# Altium schematic sheet 电源.SchDoc
size A4; SheetNumber: 2; SheetTotal: 6
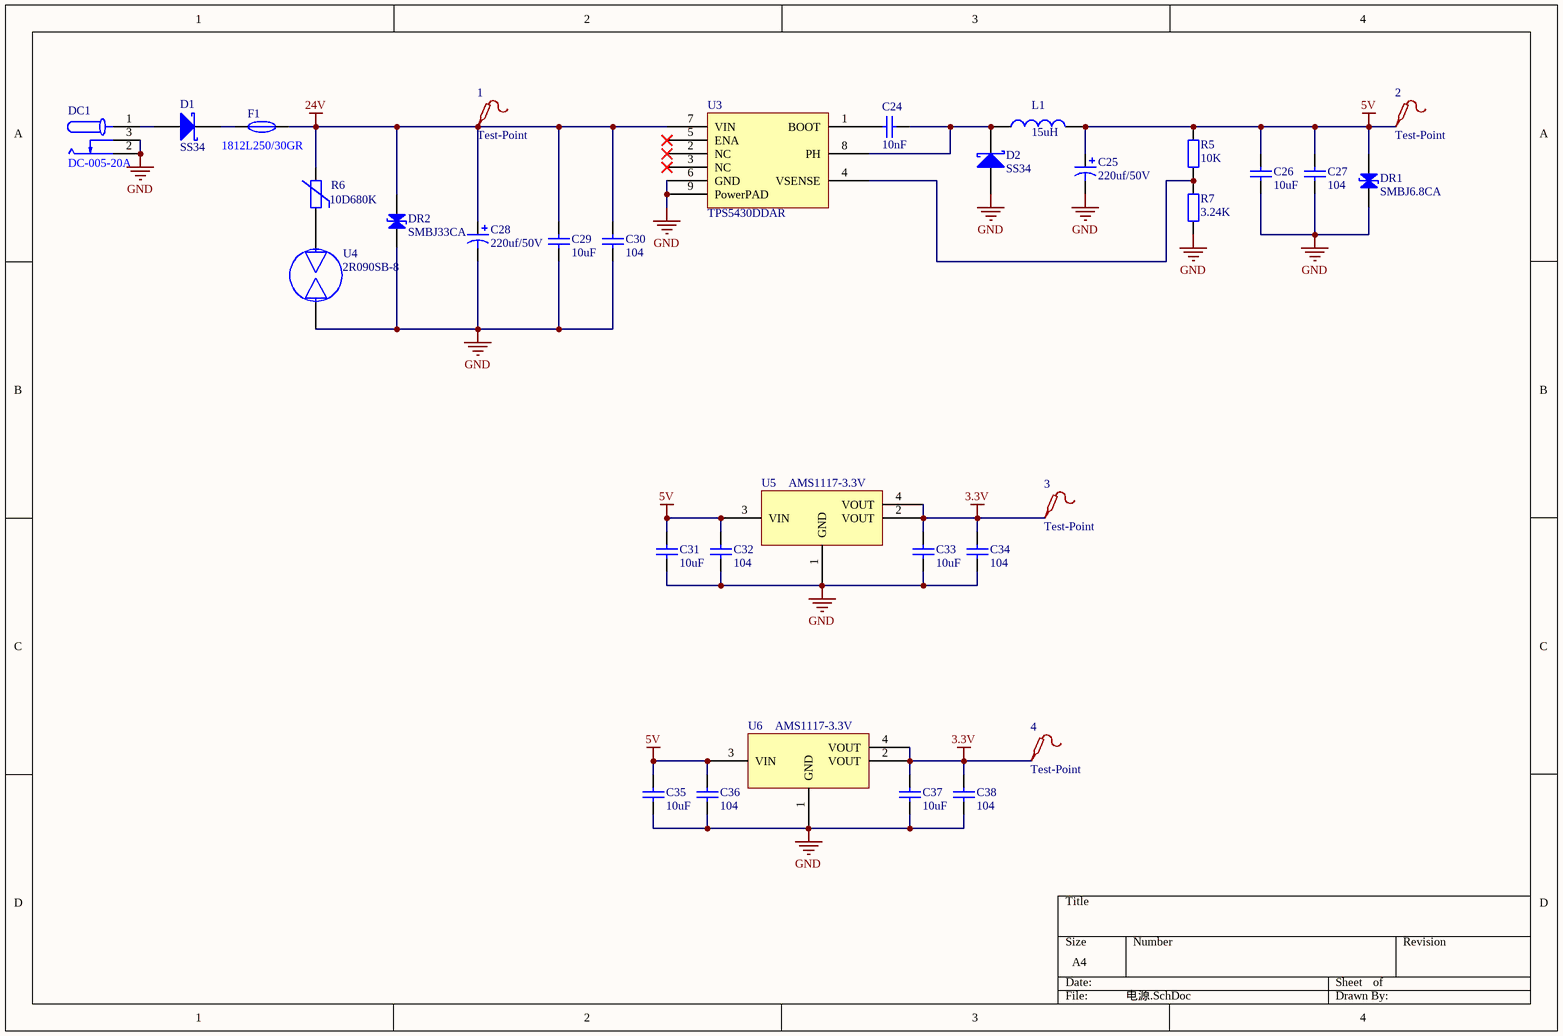
[diagram p0: 电源.SchDoc]

## Parts
1  Test-Point  [Test-Point-0.5mm]
2  Test-Point  [Test-Point-0.5mm]
3  Test-Point  [Test-Point-0.5mm]
4  Test-Point  [Test-Point-0.5mm]
C24  10nF  [C 0603_L]
C25  220uf/50V  [CAP 2.5*6.3*11.2 - GD]
C26  10uF  [C 0603_L]
C27  104  [C 0603_L]
C28  220uf/50V  [CAP 2.5*6.3*11.2 - GD]
C29  10uF  [C 0603_L]
C30  104  [C 0603_L]
C31  10uF  [C 0603_L]
C32  104  [C 0603_L]
C33  10uF  [C 0603_L]
C34  104  [C 0603_L]
C35  10uF  [C 0603_L]
C36  104  [C 0603_L]
C37  10uF  [C 0603_L]
C38  104  [C 0603_L]
D1  SS34  [SMA]
D2  SS34  [SMA]
DC1  DC-005-20A  [DC-005]
DR1  SMBJ6.8CA  [SMB]
DR2  SMBJ33CA  [SMB]
F1  1812L250/30GR  [F1812]
L1  15uH  [IND-SMD_L7.0-W6.6_FXL0630]
R5  10K  [R 0603_L]
R6  10D680K  [RES-TH_L12.0-W4.5-P7.50-D0.8-S1.60]
R7  3.24K  [R 0603_L]
U3  TPS5430DDAR  [tps5430]
U4  2R090SB-8  [DIO-DT-SMD_L8.0-W6.0]
U5  AMS1117-3.3V  [SOT-223-3_L6.5-W3.4-P2.30-LS7.0-BR]
U6  AMS1117-3.3V  [SOT-223-3_L6.5-W3.4-P2.30-LS7.0-BR]

## Nets
3.3V: 3.1 4.1 C33.2 C34.2 C37.2 C38.2 U5.2(VOUT) U5.4(VOUT) U6.2(VOUT) U6.4(VOUT)
5V: 2.1 C25.1 C26.2 C27.2 C31.2 C32.2 C35.2 C36.2 DR1.1(A) L1.2 R5.2 U5.3(VIN) U6.3(VIN)
24V: 1.1 C28.1 C29.2 C30.2 DR2.1(A) F1.2 R6.2 U3.7(VIN)
GND: C25.2 C26.1 C27.1 C28.2 C29.1 C30.1 C31.1 C32.1 C33.1 C34.1 C35.1 C36.1 C37.1 C38.1 D2.1(A) DC1.2 DC1.3 DR1.2(K) DR2.2(K) R7.1 U3.6(GND) U3.9(PowerPAD) U4.2 U5.1(GND) U6.1(GND)
NetC24_1: C24.1 D2.2(K) L1.1 U3.8(PH)
NetC24_2: C24.2 U3.1(BOOT)
NetD1_1: D1.1(A) DC1.1
NetD1_2: D1.2(K) F1.1
NetR5_1: R5.1 R7.2 U3.4(VSENSE)
NetR6_1: R6.1 U4.1

Not connected (* = marked no-connect by the designer): U3 2(NC)* 3(NC)* 5(ENA)*

## Library data of the parts
1-4 = Test-Point: Add into BOM: yes; Symbol: Test-Point; Device: Test-Point; Convert to PCB: yes
C24 C26 C27 C29-C38 = Cap: 0603贴片电容; Published: 8-Jun-2000; LatestRevisionDate: 17-Jul-2002; LatestRevisionNote: Re-released for DXP Platform.; PackageReference: RAD-0.3; Publisher: Altium Limited; PackageDescription: Radial Cap, Thru-Hole; 2 Leads; 0.3 in Pin Spacing
C25 C28 = Cap Pol1: Polarized Capacitor (Radial); Published: 8-Jun-2000; LatestRevisionDate: 17-Jul-2002; LatestRevisionNote: Re-released for DXP Platform.; PackageReference: RB7.6-15; Publisher: Altium Limited; PackageDescription: Polarized Capacitor (Radial); 2 Leads
D1 = SS34: SMA肖特基二极管; BOM名称: 肖特基二极管; 属性: 40V/3A; 封装库来自淘宝 ID：黄晶宝石: https://shop463601444.taobao.com
D2 = B340A: SMA肖特基二极管; BOM名称: 肖特基二极管; 属性: 40V/3A; 封装库来自淘宝 ID：黄晶宝石: https://shop463601444.taobao.com
DC1 = DC-005-20A: DC电源接口; Manufacturer: 韩国韩荣; Add into BOM: yes; Connector Type: DC电源插座; Inside Contact Diameter: 2mm; Outside Contact Diameter: 6.4mm; Current Rating: 500mA; Voltage Rating (Max): 30V; Symbol: DC-005-20A; Device: DC-005-20A; LCSC Part Name: DC电源插座 内径:2mm 外径:6.4mm; Supplier Part: C130239; Manufacturer Part: DC-005-20A; Supplier Footprint: 插件; Datasheet: https://item.szlcsc.com/datasheet/DC-005-20A/141526.html; Supplier: LCSC; Convert to PCB: yes; Mounting Type: 弯插; Operating Temperature: -25℃~+80℃
DR1 DR2 = TVS: DO-214AA，瞬态电压抑制二极管; 版权归属: 源创客; BOM名称: 瞬态电压抑制二极管; 学习资源: www.ooocke.com
F1 = 1812L250/30GR: 1812，自恢复保险丝; Manufacturer: LUTE(陆特); Add into BOM: yes; Voltage - Max: 30V; Current - Max: 40A; Hold Current: 2.5A; Trip Current: 5A; Power Dissipation: 1W; Resistance - Initial (Ri) (Min): 15mΩ; Resistance - Post Trip (R1) (Max): 90mΩ; Time to Trip(Max): 2.5s; Symbol: 1812L250/30GR; Device: 1812L250/30GR; LCSC Part Name: 30V 2.5A 1812自恢复保险丝; Supplier Part: C52748011; Manufacturer Part: 1812L250/30GR; Supplier Footprint: 1812; JLCPCB Part Class: 扩展库; Datasheet: https://item.szlcsc.com/datasheet/1812L250%252F30GR/55639015.html; Supplier: LCSC; Convert to PCB: yes; Operating Temperature: -40℃~+85℃; Length: 4.73mm; Width: 3.41mm; Height: 1.5mm
L1 = L: 15uH小功率贴片电感; 版权归属: 源创客; BOM名称: 小功率贴片电感; 学习资源: www.ooocke.com
R5 R7 = Res: C0603贴片电阻; BOM名称: 贴片电阻; 版权归属: 源创客; 学习资源: www.ooocke.com
R6 = R_VDR: 压敏电阻; 版权归属: 源创客; BOM名称: 压敏电阻; 学习资源: www.ooocke.com
U3 = TPS5430DDAR: DC-DC，SOIC-8-EP; Manufacturer: TI(德州仪器); Add into BOM: yes; Function: 降压型; Output Type: 可调; Input Voltage: 5.5V~36V; Output Voltage: 1.221V~32.04V; Output Current: 3A; Switching Frequency: 500kHz; Synchronous Rectification: 否; Number of Outputs: 1; Topology: 降压式; Switch tube (built-in/external): 内置; Symbol: TPS5430DDAR; Device: TPS5430DDAR; LCSC Part Name: 宽输入范围、3A输出电流的降压转换器; Supplier Part: C9864; Manufacturer Part: TPS5430DDAR; Supplier Footprint: SOIC-8-EP; JLCPCB Part Class: 基础库; Datasheet: https://www.ti.com/cn/lit/gpn/tps5430; Supplier: LCSC; Convert to PCB: yes; Operating Temperature: -40℃~+125℃@(TJ); Name: TPS5430DDAR
U4 = 2R090SB-8_C485316: 气体放电管，90V、10kA; Manufacturer: RUILON(瑞隆源); Add into BOM: yes; Number of Poles: 2; Voltage - DC Spark Over (Nom): 90V; Tolerance: ±20%; Impulse Discharge Current: 10kA; inter-electrode capacitance: 1.5pF; Symbol: 2R090SB-8_C485316; Device: 2R090SB-8_C485316; LCSC Part Name: 蓝色 90V 10kA 2端 贴片GDT; Supplier Part: C485316; Manufacturer Part: 2R090SB-8; Supplier Footprint: SMD,8x6mm; JLCPCB Part Class: 扩展库; Datasheet: https://item.szlcsc.com/datasheet/2R090SB-8/493582.html; Supplier: LCSC; Convert to PCB: yes
U5 U6 = AMS1117-3.3V: 线性稳压器